# Altium schematic sheet Ethernet.SchDoc
size A3; Author: Швецов С.В.; Organization: PapuaSoft; SheetNumber: 8; SheetTotal: 8
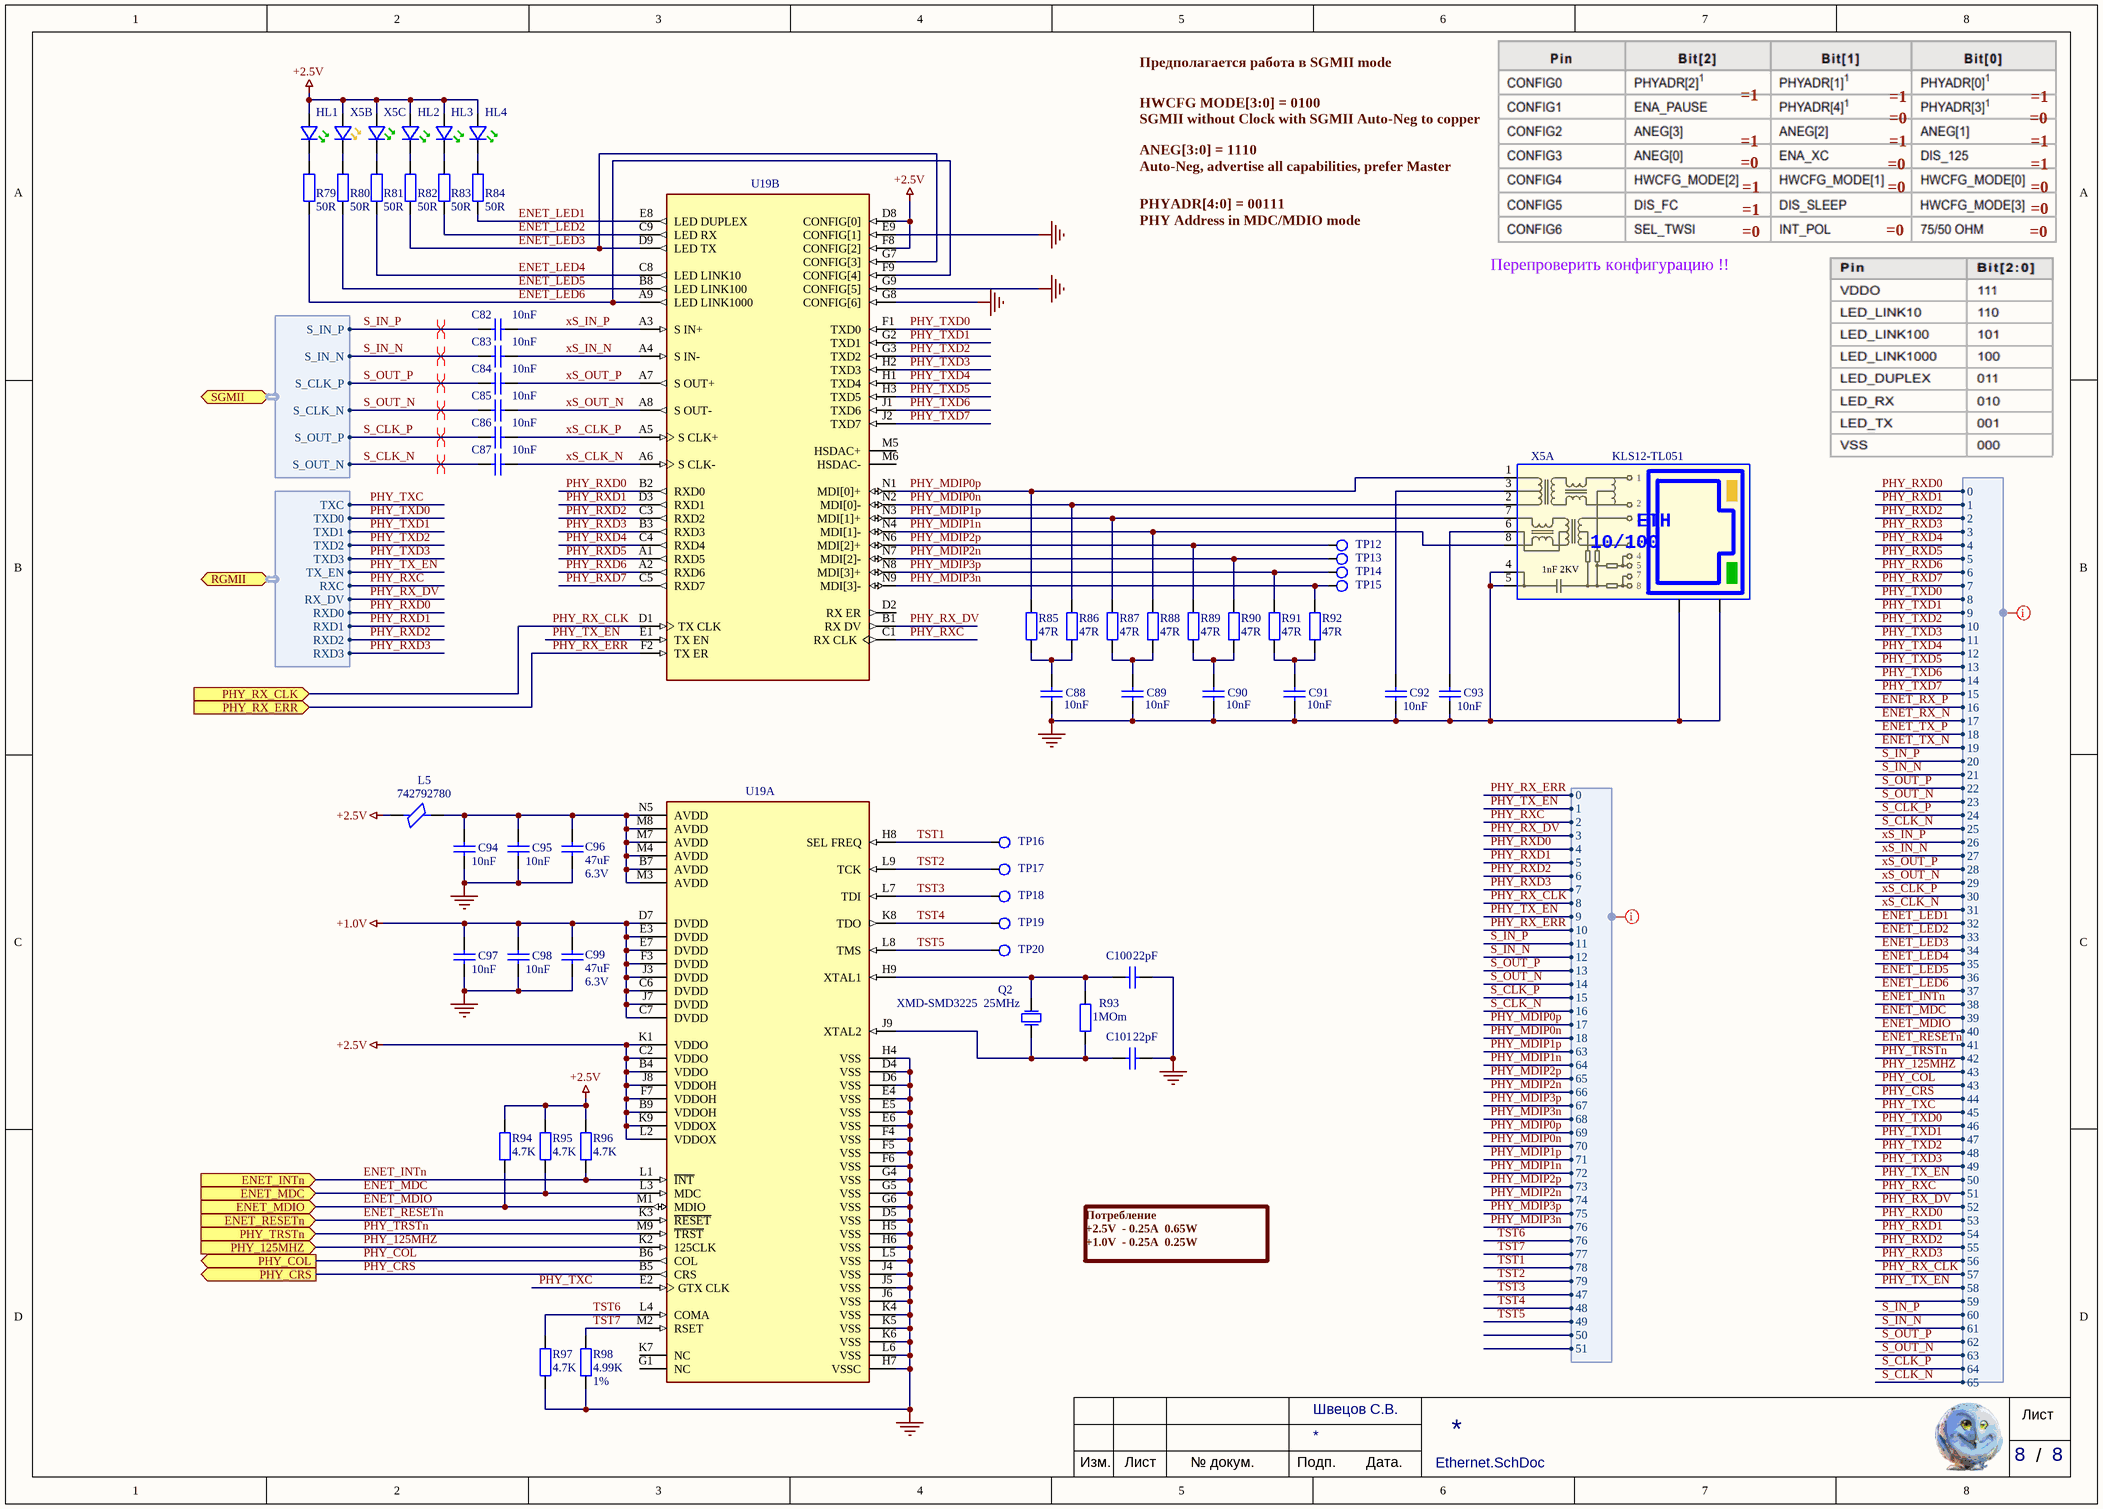
[diagram p0: Ethernet.SchDoc]

## Parts
C82  value 10nF  [C0402]  (hidden comment: Cap)
C83  value 10nF  [C0402]  (hidden comment: Cap)
C84  value 10nF  [C0402]  (hidden comment: Cap)
C85  value 10nF  [C0402]  (hidden comment: Cap)
C86  value 10nF  [C0402]  (hidden comment: Cap)
C87  value 10nF  [C0402]  (hidden comment: Cap)
C88  value 10nF  [C0402]  (hidden comment: Cap)
C89  value 10nF  [C0402]  (hidden comment: Cap)
C90  value 10nF  [C0402]  (hidden comment: Cap)
C91  value 10nF  [C0402]  (hidden comment: Cap)
C92  value 10nF  [C0402]  (hidden comment: Cap)
C93  value 10nF  [C0402]  (hidden comment: Cap)
C94  value 10nF  [C0402]  (hidden comment: Cap)
C95  value 10nF  [C0402]  (hidden comment: Cap)
C96  value 47uF  Voltage: 6.3V  [C0805]  (hidden comment: Cap)
C97  value 10nF  [C0402]  (hidden comment: Cap)
C98  value 10nF  [C0402]  (hidden comment: Cap)
C99  value 47uF  Voltage: 6.3V  [C0805]  (hidden comment: Cap)
C100  value 22pF  [C0402]  (hidden comment: Cap)
C101  value 22pF  [C0402]  (hidden comment: Cap)
HL1  (no value)  [KP-1608_16x08x11_L]
HL2  (no value)  [KP-1608_16x08x11_L]
HL3  (no value)  [KP-1608_16x08x11_L]
HL4  (no value)  [KP-1608_16x08x11_L]
L5  742792780  [L0402]
Q2  XMD-SMD3225  25MHz  [KX-5T]
R79  value 50R  [R0402]  (hidden comment: Res2)
R80  value 50R  [R0402]  (hidden comment: Res2)
R81  value 50R  [R0402]  (hidden comment: Res2)
R82  value 50R  [R0402]  (hidden comment: Res2)
R83  value 50R  [R0402]  (hidden comment: Res2)
R84  value 50R  [R0402]  (hidden comment: Res2)
R85  value 47R  [R0402]  (hidden comment: Res2)
R86  value 47R  [R0402]  (hidden comment: Res2)
R87  value 47R  [R0402]  (hidden comment: Res2)
R88  value 47R  [R0402]  (hidden comment: Res2)
R89  value 47R  [R0402]  (hidden comment: Res2)
R90  value 47R  [R0402]  (hidden comment: Res2)
R91  value 47R  [R0402]  (hidden comment: Res2)
R92  value 47R  [R0402]  (hidden comment: Res2)
R93  value 1MOm  [R0402]  (hidden comment: Res2)
R94  value 4.7K  [R0402]  (hidden comment: Res2)
R95  value 4.7K  [R0402]  (hidden comment: Res2)
R96  value 4.7K  [R0402]  (hidden comment: Res2)
R97  value 4.7K  [R0402]  (hidden comment: Res2)
R98  value 4.99K  Precision: 1%  [R0402]  (hidden comment: Res2)
TP12  (no value)  [TP_0MM5_1MM0]  (no BOM)
TP13  (no value)  [TP_0MM5_1MM0]  (no BOM)
TP14  (no value)  [TP_0MM5_1MM0]  (no BOM)
TP15  (no value)  [TP_0MM5_1MM0]  (no BOM)
TP16  (no value)  [TP_0MM5_1MM0]  (no BOM)
TP17  (no value)  [TP_0MM5_1MM0]  (no BOM)
TP18  (no value)  [TP_0MM5_1MM0]  (no BOM)
TP19  (no value)  [TP_0MM5_1MM0]  (no BOM)
TP20  (no value)  [TP_0MM5_1MM0]  (no BOM)
U19  88E1111-B2-BAB1C000  [Marvell_88E1111-B2-BAB1C000_0]  (value not drawn)  (parts A,B of 2)
X5  KLS12-TL051  [KLS12-TL051]  (parts A,B,C of 3)

## Ports
ENET_INTn (in), ENET_MDC (in), ENET_MDIO (in), ENET_RESETn (in), PHY_125MHZ (in), PHY_COL (out), PHY_CRS (out), PHY_RX_CLK (in), PHY_RX_ERR (in), PHY_TRSTn (in), RGMII (bidir, harness RGMII), SGMII (bidir, harness SGMII)

## Harnesses
Ethernet: 0, 1, 2, 3, 4, 5, 6, 7, 8, 9, 11, 12, 10, 13, 14, 15, 16, 17, 18, 19, 20, 21, 22, 23, 24, 25, 26, 27, 28, 29, 30, 31, 32, 33, 34, 35, 36, 37, 38, 39, 40, 41, 42, 43, 43, 44, 45, 46, 47, 48, 49, 50, 51, 52, 53, 54, 55, 56, 57, 58, 59, 60, 61, 62, 63, 64, 65
SGMII: S_IN_P, S_IN_N, S_CLK_P, S_CLK_N, S_OUT_P, S_OUT_N
RGMII: TXC, TXD0, TXD1, TXD2, TXD3, TX_EN, RXC, RX_DV, RXD0, RXD1, RXD2, RXD3
Ethernet2: 0, 1, 2, 3, 4, 5, 6, 7, 8, 9, 10, 12, 13, 14, 11, 15, 16, 17, 18, 63, 64, 65, 66, 67, 68, 69, 70, 71, 72, 73, 74, 75, 76, 76, 77, 78, 79, 47, 48, 49, 50, 51

## Nets
+1.0V: C97.1 C98.1 C99.1 U19.C6(DVDD) U19.C7(DVDD) U19.D7(DVDD) U19.E3(DVDD) U19.E7(DVDD) U19.F3(DVDD) U19.J3(DVDD) U19.J7(DVDD)
+2.5V: HL1.1(Anode) HL2.1(Anode) HL3.1(Anode) HL4.1(Anode) L5.1 R94.1 R95.1 R96.1 U19.B4(VDDO) U19.B9(VDDOH) U19.C2(VDDO) U19.D8(CONFIG[0]) U19.F7(VDDOH) U19.F8(CONFIG[2]) U19.J8(VDDOH) U19.K1(VDDO) U19.K9(VDDOX) U19.L2(VDDOX) X5.9 X5.12
GND: C88.2 C89.2 C90.2 C91.2 C92.2 C93.2 C94.2 C95.2 C96.2 C97.2 C98.2 C99.2 C100.2 C101.2 R97.2 R98.1 U19.D4(VSS) U19.D5(VSS) U19.D6(VSS) U19.E4(VSS) U19.E5(VSS) U19.E6(VSS) U19.E9(CONFIG[1]) U19.F4(VSS) U19.F5(VSS) U19.F6(VSS) U19.G4(VSS) U19.G5(VSS) U19.G6(VSS) U19.G8(CONFIG[6]) U19.G9(CONFIG[5]) U19.H4(VSS) U19.H5(VSS) U19.H6(VSS) U19.H7(VSSC) U19.J4(VSS) U19.J5(VSS) U19.J6(VSS) U19.K4(VSS) U19.K5(VSS) U19.K6(VSS) U19.L5(VSS) U19.L6(VSS) X5.0(PAD1) X5.4 X5.5
ENET_INTn: R96.2 U19.L1(~{INT}) ; port ENET_INTn, harness Ethernet.38
ENET_LED1: R84.1 U19.E8(LED_DUPLEX) ; harness Ethernet.32
ENET_LED2: R83.1 U19.C9(LED_RX) ; harness Ethernet.33
ENET_LED3: R82.1 U19.D9(LED_TX) U19.G7(CONFIG[3]) ; harness Ethernet.34
ENET_LED4: R81.1 U19.C8(LED_LINK10) ; harness Ethernet.35
ENET_LED5: R80.1 U19.B8(LED_LINK100) ; harness Ethernet.36
ENET_LED6: R79.1 U19.A9(LED_LINK1000) U19.F9(CONFIG[4]) ; harness Ethernet.37
ENET_MDC: R95.2 U19.L3(MDC) ; port ENET_MDC, harness Ethernet.39
ENET_MDIO: R94.2 U19.M1(MDIO) ; port ENET_MDIO, harness Ethernet.40
ENET_RESETn: U19.K3(~{RESET}) ; port ENET_RESETn, harness Ethernet.41
ENET_RX_N: harness Ethernet.17
ENET_RX_P: harness Ethernet.16
ENET_TX_N: harness Ethernet.19
ENET_TX_P: harness Ethernet.18
PHY_125MHZ: U19.B6(COL) U19.K2(125CLK) ; port PHY_125MHZ, port PHY_COL, harness Ethernet.43  [also labelled PHY_COL]
PHY_CRS: U19.B5(CRS) ; port PHY_CRS, harness Ethernet.44
PHY_MDIP0n: R86.1 U19.N2(MDI[0]-) X5.2 ; harness Ethernet2.18, harness Ethernet2.70
PHY_MDIP0p: R85.1 U19.N1(MDI[0]+) X5.1 ; harness Ethernet2.17, harness Ethernet2.69
PHY_MDIP1n: R88.1 U19.N4(MDI[1]-) X5.8 ; harness Ethernet2.64, harness Ethernet2.72
PHY_MDIP1p: R87.1 U19.N3(MDI[1]+) X5.7 ; harness Ethernet2.63, harness Ethernet2.71
PHY_MDIP2n: R90.1 TP13.1(e1) U19.N7(MDI[2]-) ; harness Ethernet2.66, harness Ethernet2.74
PHY_MDIP2p: R89.1 TP12.1(e1) U19.N6(MDI[2]+) ; harness Ethernet2.65, harness Ethernet2.73
PHY_MDIP3n: R92.1 R97.1 TP15.1(e1) U19.L4(COMA) U19.N9(MDI[3]-) ; harness Ethernet2.68, harness Ethernet2.76  [also labelled TST6]
PHY_MDIP3p: R91.1 TP14.1(e1) U19.N8(MDI[3]+) ; harness Ethernet2.67, harness Ethernet2.75
PHY_RX_CLK: U19.D1(TX_CLK) ; port PHY_RX_CLK, harness Ethernet.57, harness Ethernet2.8
PHY_RX_DV: U19.B1(RX_DV) ; harness Ethernet.52, port RGMII.RX_DV, harness Ethernet2.3
PHY_RX_ERR: U19.F2(TX_ER) ; port PHY_RX_ERR, harness Ethernet2.0, harness Ethernet2.10
PHY_RXC: U19.C1(RX_CLK) ; harness Ethernet.51, port RGMII.RXC, harness Ethernet2.2
PHY_RXD0: U19.B2(RXD0) ; harness Ethernet.0, harness Ethernet.53, port RGMII.RXD0, harness Ethernet2.4
PHY_RXD1: U19.D3(RXD1) ; harness Ethernet.1, harness Ethernet.54, port RGMII.RXD1, harness Ethernet2.5
PHY_RXD2: U19.C3(RXD2) ; harness Ethernet.2, harness Ethernet.55, port RGMII.RXD2, harness Ethernet2.6
PHY_RXD3: U19.B3(RXD3) ; harness Ethernet.3, harness Ethernet.56, port RGMII.RXD3, harness Ethernet2.7
PHY_RXD4: U19.C4(RXD4) ; harness Ethernet.4
PHY_RXD5: U19.A1(RXD5) ; harness Ethernet.5
PHY_RXD6: U19.A2(RXD6) ; harness Ethernet.6
PHY_RXD7: U19.C5(RXD7) ; harness Ethernet.7
PHY_TRSTn: U19.M9(~{TRST}) ; port PHY_TRSTn, harness Ethernet.42
PHY_TX_EN: U19.E1(TX_EN) ; harness Ethernet.50, harness Ethernet.58, port RGMII.TX_EN, harness Ethernet2.1, harness Ethernet2.9
PHY_TXC: U19.E2(GTX_CLK) ; harness Ethernet.45, port RGMII.TXC
PHY_TXD0: U19.F1(TXD0) ; harness Ethernet.8, harness Ethernet.46, port RGMII.TXD0
PHY_TXD1: U19.G2(TXD1) ; harness Ethernet.9, harness Ethernet.47, port RGMII.TXD1
PHY_TXD2: U19.G3(TXD2) ; harness Ethernet.10, harness Ethernet.48, port RGMII.TXD2
PHY_TXD3: U19.H2(TXD3) ; harness Ethernet.11, harness Ethernet.49, port RGMII.TXD3
PHY_TXD4: U19.H1(TXD4) ; harness Ethernet.12
PHY_TXD5: U19.H3(TXD5) ; harness Ethernet.13
PHY_TXD6: U19.J1(TXD6) ; harness Ethernet.14
PHY_TXD7: U19.J2(TXD7) ; harness Ethernet.15
S_CLK_N: C87.1 ; harness Ethernet.25, harness Ethernet.65, port SGMII.S_OUT_N, harness Ethernet2.16
S_CLK_P: C86.1 ; harness Ethernet.24, harness Ethernet.64, port SGMII.S_OUT_P, harness Ethernet2.15
S_IN_N: C83.1 ; harness Ethernet.21, harness Ethernet.61, port SGMII.S_IN_N, harness Ethernet2.12
S_IN_P: C82.2 ; harness Ethernet.20, harness Ethernet.60, port SGMII.S_IN_P, harness Ethernet2.11
S_OUT_N: C85.1 ; harness Ethernet.23, harness Ethernet.63, port SGMII.S_CLK_N, harness Ethernet2.14
S_OUT_P: C84.1 ; harness Ethernet.22, harness Ethernet.62, port SGMII.S_CLK_P, harness Ethernet2.13
TST1: TP16.1(e1) U19.H8(SEL_FREQ) ; harness Ethernet2.78
TST2: TP17.1(e1) U19.L9(TCK) ; harness Ethernet2.79
TST3: TP18.1(e1) U19.L7(TDI) ; harness Ethernet2.47
TST4: TP19.1(e1) U19.K8(TDO) ; harness Ethernet2.48
TST5: TP20.1(e1) U19.L8(TMS) ; harness Ethernet2.49
TST7: R98.2 U19.M2(RSET) ; harness Ethernet2.77
xS_CLK_N: C87.2 U19.A6(S_CLK-) ; harness Ethernet.31
xS_CLK_P: C86.2 U19.A5(S_CLK+) ; harness Ethernet.30
xS_IN_N: C83.2 U19.A4(S_IN-) ; harness Ethernet.27
xS_IN_P: C82.1 U19.A3(S_IN+) ; harness Ethernet.26
xS_OUT_N: C85.2 U19.A8(S_OUT-) ; harness Ethernet.29
xS_OUT_P: C84.2 U19.A7(S_OUT+) ; harness Ethernet.28
NetC88_1: C88.1 R85.2 R86.2
NetC89_1: C89.1 R87.2 R88.2
NetC90_1: C90.1 R89.2 R90.2
NetC91_1: C91.1 R91.2 R92.2
NetC92_1: C92.1 X5.3
NetC93_1: C93.1 X5.6
NetC94_1: C94.1 C95.1 C96.1 L5.2 U19.B7(AVDD) U19.M3(AVDD) U19.M4(AVDD) U19.M7(AVDD) U19.M8(AVDD) U19.N5(AVDD)
NetC100_1: C100.1 Q2.3(OSC2) R93.1 U19.H9(XTAL1)
NetC101_1: C101.1 Q2.1(OSC1) R93.2 U19.J9(XTAL2)
NetHL1_2: HL1.2(Cathode) R79.2
NetHL2_2: HL2.2(Cathode) R82.2
NetHL3_2: HL3.2(Cathode) R83.2
NetHL4_2: HL4.2(Cathode) R84.2
NetR80_2: R80.2 X5.11
NetR81_2: R81.2 X5.10

Not connected (* = marked no-connect by the designer): U19 D2(RX_ER) G1(NC) K7(NC) M5(HSDAC+) M6(HSDAC-)

## Layout directives
net class Ethernet: (no net found under the mark)
differential pair: S_CLK_N, S_CLK_P, S_IN_N, S_IN_P, S_OUT_N, S_OUT_P
net class Ethernet2: (no net found under the mark)

## Notes on the sheet
- Предполагается работа в SGMII mode
- HWCFG MODE[3:0] = 0100
  SGMII without Clock with SGMII Auto-Neg to copper
- ANEG[3:0] = 1110
  Auto-Neg, advertise all capabilities, prefer Master
- PHYADR[4:0] = 00111
  PHY Address in MDC/MDIO mode
- Перепроверить конфигурацию !!
- Потребление
  +2.5V  - 0.25A  0.65W
  +1.0V  - 0.25A  0.25W
- Лист
- /
- Изм.
- № докум.
- Подп.
- Дата.
- (in symbol KLS12-TL051, part A) ETH; 10/100; 1nF 2KV

## Library data of the parts
C82-C95 C97 C98 = Cap: Конденсатор керамический; Voltage: 25V; PackageReference: 0402; ClassName: Ethernet
C96 C99 = Cap: C0805C476M9PAC; PackageReference: 0805; ClassName: Xilinx PWR
C100 C101 = Cap: Конденсатор керамический; PackageReference: 0402; ClassName: Ethernet
HL1-HL4 = ledG_KP-1608MGC_KP-1608: 1.6X0.8mm SMD  LED; LxWxH(mm): 1,6x0,8x1,1; Value: KP-1608MGC; PackageReference: 0603; Package: KP-1608_16x08x11; ClassName: Ethernet
L5 = BEAD_FERRITE_SM: Wurth Elektronik EMI FILTERS FERRITE BEAD, 220R@100MHz, 0.35R; PackageReference: 0402; Value: 742792780; ClassName: Ethernet
Q2 = XTAL: Chengdu Kingbri Frequency Technology Co., Ltd 25MHz; Value: 01XMD118JVF0025000000; PackageReference: SMD 3.2x2.5мм; ClassName: Ethernet
R79-R84 = Res2: Резистор; Precision: 1%; PackageReference: 0402; ClassName: Ethernet
R85-R98 = Res2: Резистор; PackageReference: 0402; ClassName: Ethernet
TP12-TP16 = Test_Point: Тестовая точка на плате; ClassName: Ethernet
TP17 = Test_Point: Тестовая точка на плате; MarkPCB: TCK; ClassName: Ethernet
TP18 = Test_Point: Тестовая точка на плате; MarkPCB: TDI; ClassName: Ethernet
TP19 = Test_Point: Тестовая точка на плате; MarkPCB: TDO; ClassName: Ethernet
TP20 = Test_Point: Тестовая точка на плате; MarkPCB: TMS; ClassName: Ethernet
U19 = 88E1111-B2-BAB1C000: Integrated 10/100/1000 Ultra Gigabit Ethernet Transceiver; Value: 88E1111-B2-BAB1C000; PackageReference: QFN96; ClassName: Ethernet
X5 = KLS12-TL051: 10/100 RJ45 с трансформаторами и двумя светодиодами; Value: KLS12-TL051